# EAGLE design ShieldV21 (EAGLE 6.1)
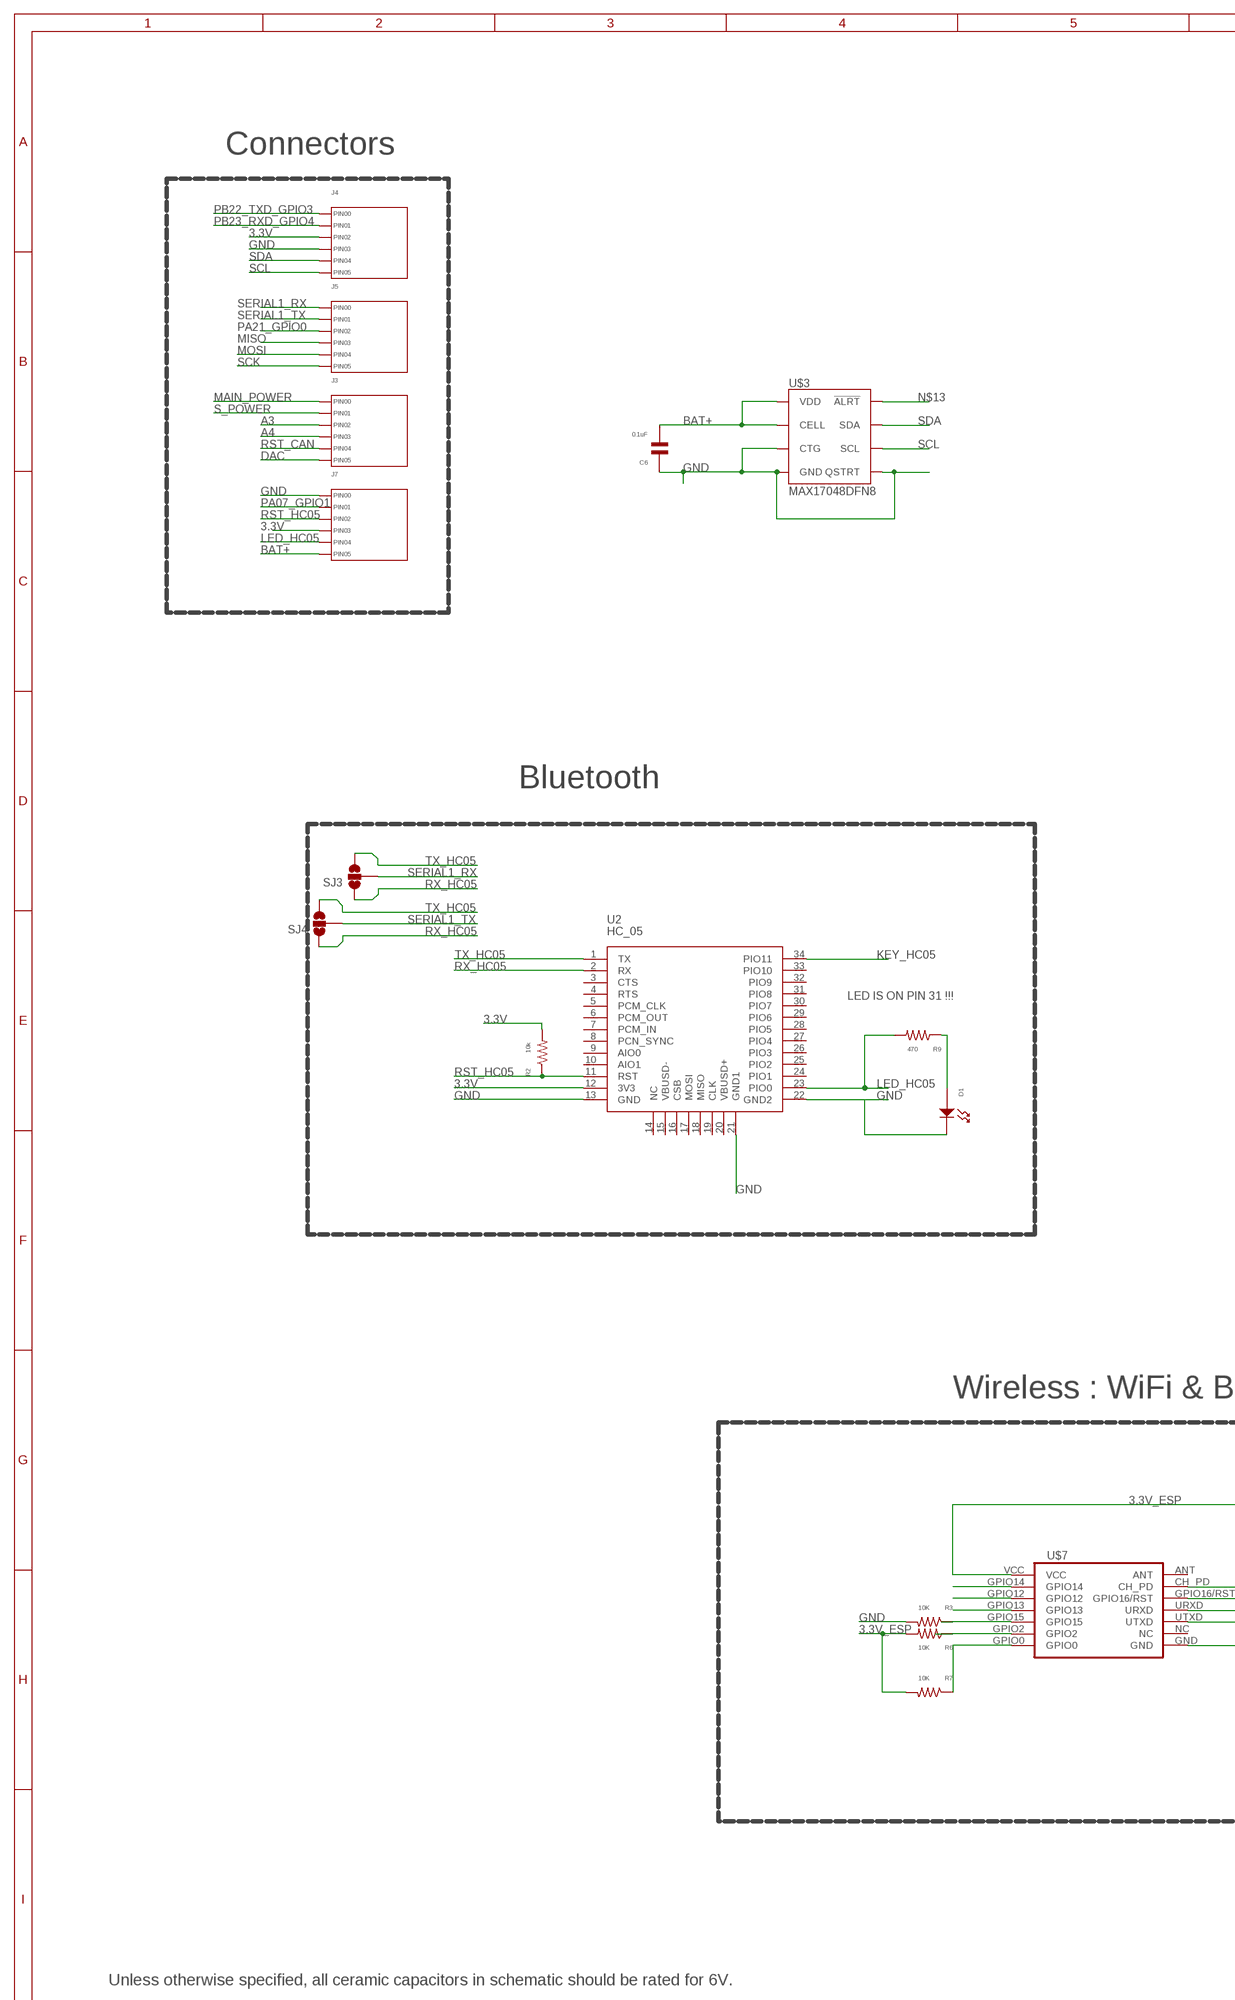
[diagram p0: schematic, sheet 1, part 1 of 2]
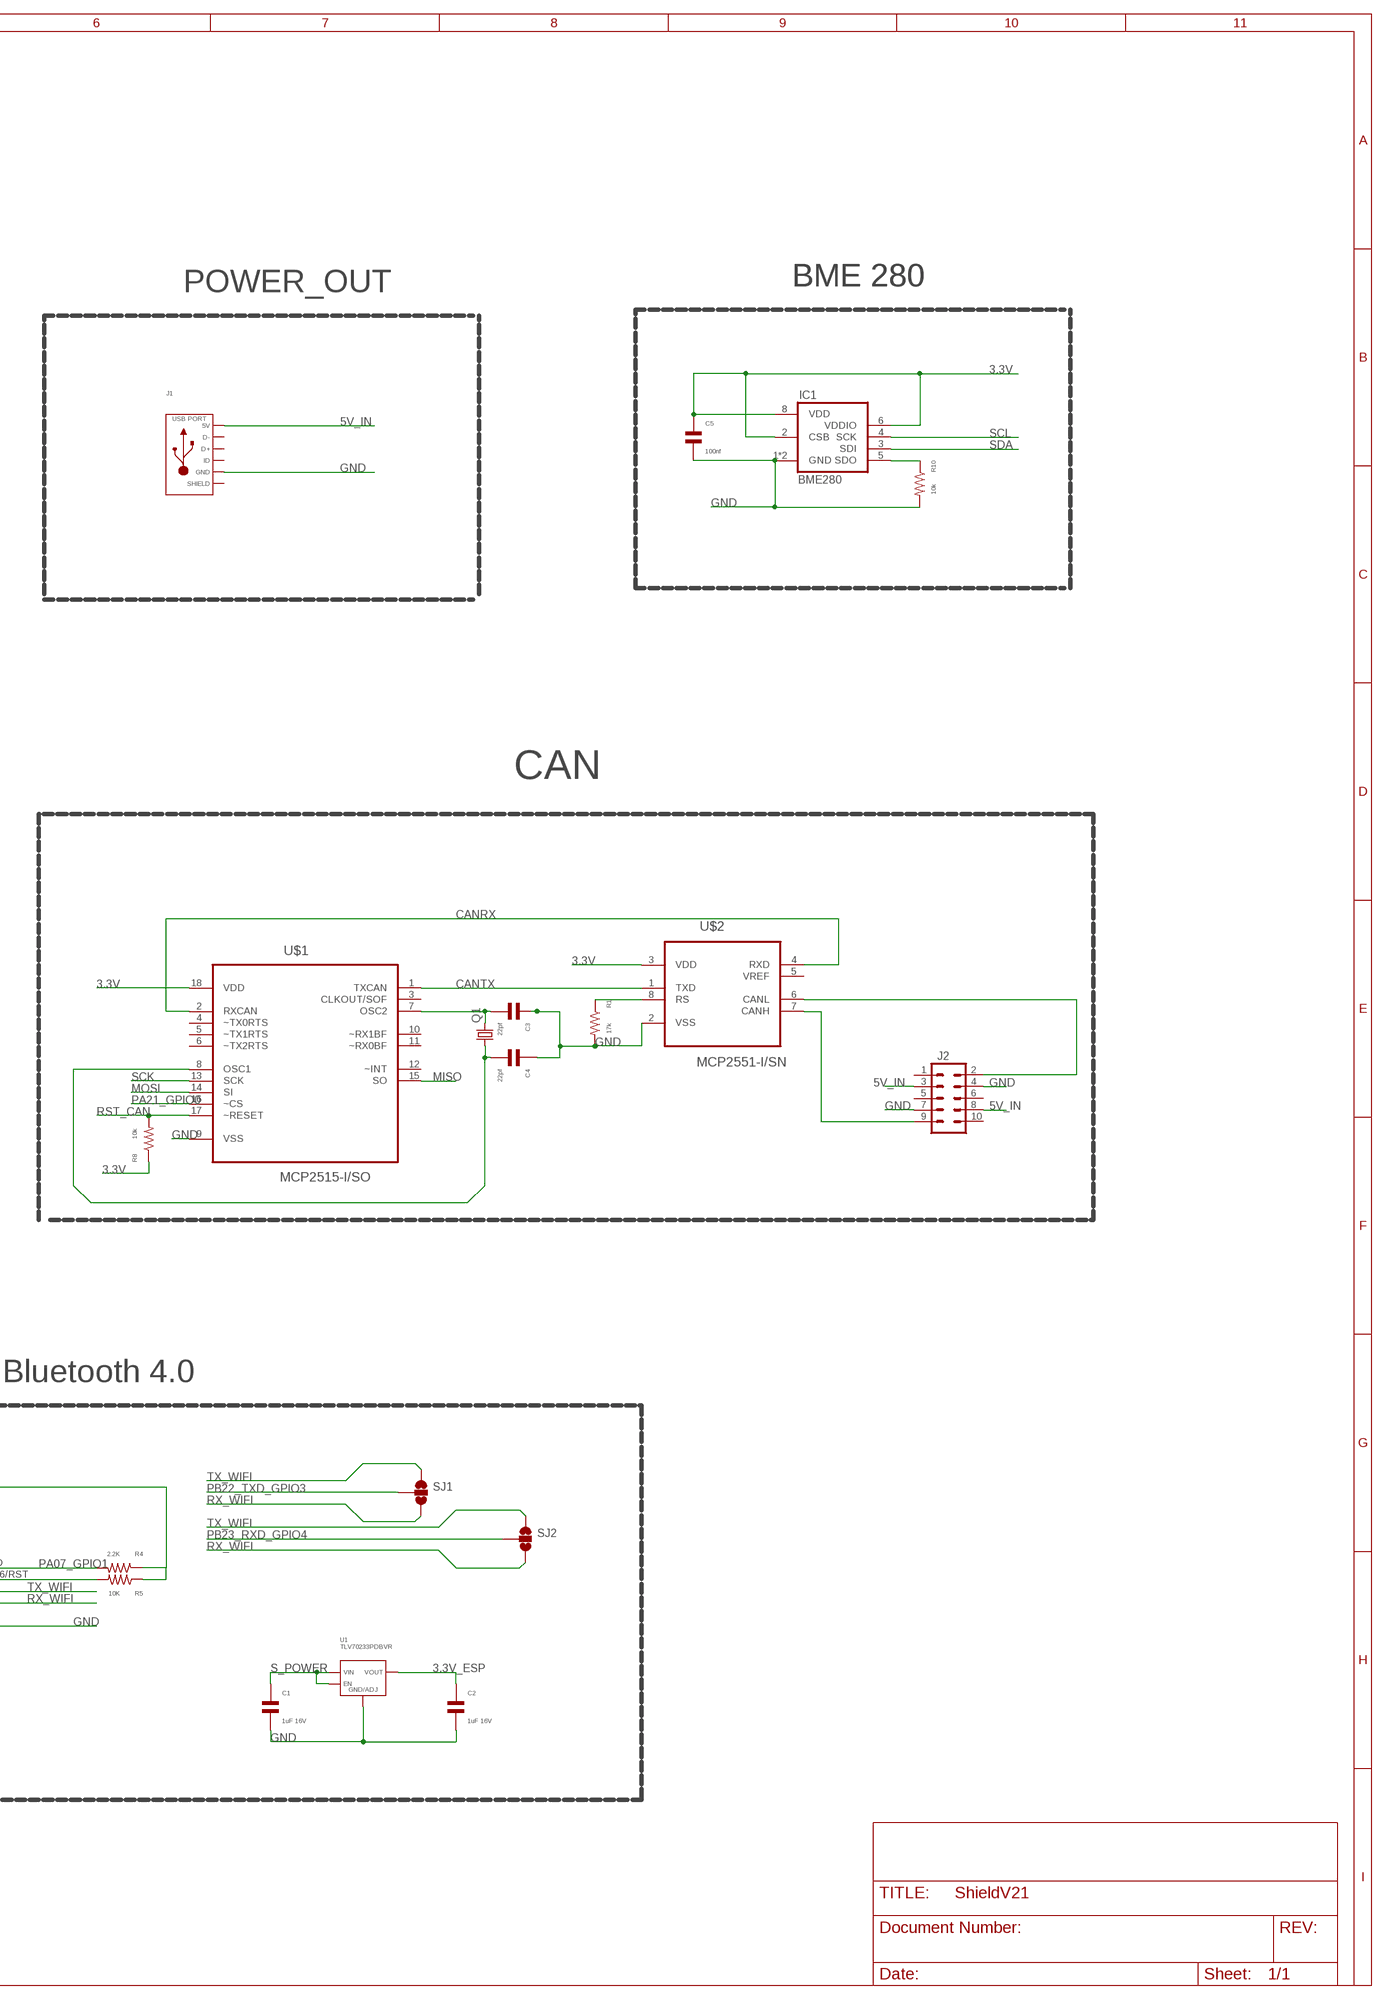
[diagram p1: schematic, sheet 1, part 2 of 2]

## Parts
C1  1uF 16V  CAPACITOR_NP_0402  [C0402]
C2  1uF 16V  CAPACITOR_NP_0402  [C0402]
C3  22pf  CAPACITOR_NP_0402  [C0402]
C4  22pf  CAPACITOR_NP_0402  [C0402]
C5  100nf  CAPACITOR_NP_0402  [C0402]
C6  0.1uF  CAPACITOR_NP_0402  [C0402]
D1  LED_SINGLE_0805  [LED0805]
IC1  BME280  [BME280]
J1  USB_MICRO_RIGHT  [MICROUSB-RIGHT]
J2  M05X2RA  [2X5-RA]
J3  HEADER_01X06_PTH_2.54MM  [PTH_2.54MM_01X06]
J4  HEADER_01X06_PTH_2.54MM  [PTH_2.54MM_01X06]
J5  HEADER_01X06_PTH_2.54MM  [PTH_2.54MM_01X06]
J7  HEADER_01X06_PTH_2.54MM  [PTH_2.54MM_01X06]
Q1  CRYSTALHC49UP  [HC49UP]
R1  17k  RESISTOR_0402  [R0402]
R2  10k  RESISTOR_0402  [R0402]
R3  10K  RESISTOR_0402  [R0402]
R4  2.2K  RESISTOR_0402  [R0402]
R5  10K  RESISTOR_0402  [R0402]
R6  10K  RESISTOR_0402  [R0402]
R7  10K  RESISTOR_0402  [R0402]
R8  10k  RESISTOR_0402  [R0402]
R9  470  RESISTOR_0402  [R0402]
R10  10k  RESISTOR_0402  [R0402]
SJ1  SOLDERJUMPER_2WAYS  [SJ_3]
SJ2  SOLDERJUMPER_2WAYS  [SJ_3]
SJ3  SOLDERJUMPER_2WAYS  [SJ_3]
SJ4  SOLDERJUMPER_2WAYS  [SJ_3]
U1  TLV70233PDBVR  [SOT-23-5]
U2  HC_05  [BLUETOOTH_SMD]
U$1  MCP2515-I/SO  [SOIC127P1034X264-18N]
U$2  MCP2551-I/SN  [SOIC127P600X175-8N]
U$3  MAX17048DFN8  [DFN-8]
U$7  ESP-03_NO_SOLDER  [ESP-03_NO_SOLDER_PASTE]

## Nets
3.3V [3.3V]: C5.P$1 IC1.2(CSB) IC1.6(VDDIO) IC1.8(VDD) J4.P$3(PIN2) J7.P$4(PIN3) R2.P$2 R8.P$1 U2.12(3V3) U$1.18(VDD) U$2.3(VDD)
3.3V_ESP: C2.P$1 R4.P$1 R5.P$1 R6.P$2 R7.P$2 U1.P$5(VOUT) U$7.VCC
5V_IN: J1.1(5V) J2.3 J2.8
A3: J3.P$3(PIN2)
A4: J3.P$4(PIN3)
BAT+ [Large]: C6.P$2 J7.P$6(PIN5) U$3.P$2(CELL) U$3.P$3(VDD)
CANH: J2.9 U$2.7(CANH)
CANRX: U$1.2(RXCAN) U$2.4(RXD)
CANTX: U$1.1(TXCAN) U$2.1(TXD)
DAC: J3.P$6(PIN5)
GND [gnd]: C1.P$2 C2.P$2 C3.P$1 C4.P$1 C5.P$2 C6.P$1 D1.CATHODE IC1.1(GND) IC1.7(GND) J1.5(GND) J2.4 J2.7 J4.P$4(PIN3) J7.P$1(PIN0) R1.P$2 R3.P$2 R10.P$2 U1.P$2(GND/ADJ) U2.13(GND) U2.21(GND1) U2.22(GND2) U$1.9(VSS) U$2.2(VSS) U$3.P$1(CTG) U$3.P$4(GND) U$3.P$6(QSTRT) U$3.P$9(GND) U$7.GND
KEY_HC05 [gnd]: U2.34(PIO11)
LED_HC05: J7.P$5(PIN4) R9.P$2 U2.23(PIO0)
MAIN_POWER: J3.P$1(PIN0)
MISO: J5.P$4(PIN3) U$1.15(SO)
MOSI: J5.P$5(PIN4) U$1.14(SI)
N$3: D1.ANODE R9.P$1
N$5: C3.P$2 Q1.2 U$1.7(OSC2)
N$6: C4.P$2 Q1.1 U$1.8(OSC1)
N$7: J2.2 U$2.6(CANL)
N$8: R1.P$1 U$2.8(RS)
N$9: R5.P$2 U$7.GPIO16/RST
N$10: IC1.5(SDO) R10.P$1
N$13: U$3.P$5(!ALRT)
N$14 [audio]: R7.P$1 U$7.GPIO0
N$15 [audio]: R6.P$1 U$7.GPIO2
N$16 [audio]: R3.P$1 U$7.GPIO15
N$17 [audio]: U$7.GPIO13
N$18 [audio]: U$7.GPIO12
N$19 [audio]: U$7.GPIO14
PA07_GPIO1: J7.P$2(PIN1) R4.P$2 U$7.CH_PD
PA21_GPIO0: J5.P$3(PIN2) U$1.16(~CS)
PB22_TXD_GPIO3: J4.P$1(PIN0) SJ1.2
PB23_RXD_GPIO4: J4.P$2(PIN1) SJ2.2
RST_CAN: J3.P$5(PIN4) R8.P$2 U$1.17(~RESET)
RST_HC05: J7.P$3(PIN2) R2.P$1 U2.11(RST)
RX_HC05: SJ3.1 SJ4.1 U2.2(RX)
RX_WIFI: SJ1.3 SJ2.3 U$7.UTXD
S_POWER: C1.P$1 J3.P$2(PIN1) U1.P$1(VIN) U1.P$3(EN)
SCK: J5.P$6(PIN5) U$1.13(SCK)
SCL: IC1.4(SCK) J4.P$6(PIN5) U$3.P$7(SCL)
SDA: IC1.3(SDI) J4.P$5(PIN4) U$3.P$8(SDA)
SERIAL1_RX: J5.P$1(PIN0) SJ3.2
SERIAL1_TX: J5.P$2(PIN1) SJ4.2
TX_HC05: SJ3.3 SJ4.3 U2.1(TX)
TX_WIFI: SJ1.1 SJ2.1 U$7.URXD
Unconnected: J1.2(D-) J1.3(D+) J1.4(ID) J2.1 J2.5 J2.6 J2.10 U2.3(CTS) U2.4(RTS) U2.5(PCM_CLK) U2.6(PCM_OUT) U2.7(PCM_IN) U2.8(PCN_SYNC) U2.9(AIO0) U2.10(AIO1) U2.14(NC) U2.15(VBUSD-) U2.16(CSB) U2.17(MOSI) U2.18(MISO) U2.19(CLK) U2.20(VBUSD+) U2.24(PIO1) U2.25(PIO2) U2.26(PIO3) U2.27(PIO4) U2.28(PIO5) U2.29(PIO6) U2.30(PIO7) U2.31(PIO8) U2.32(PIO9) U2.33(PIO10) U$1.3(CLKOUT/SOF) U$1.4(~TX0RTS) U$1.5(~TX1RTS) U$1.6(~TX2RTS) U$1.10(~RX1BF) U$1.11(~RX0BF) U$1.12(~INT) U$2.5(VREF) U$7.ANT U$7.NC

## Notes on the sheet
- Connectors
- POWER_OUT | BME 280 | BME 280
- Bluetooth | CAN
- LED IS ON PIN 31 !!!
- Wireless : WiFi & Bluetooth 4.0
- Unless otherwise specified, all ceramic capacitors in schematic should be rated for 6V.

## Power pins joined to a net without a drawn wire
SLD: J1.S1(SLD) J1.S2(SLD) J1.S3(SLD) J1.S4(SLD) J1.S5(SLD) J1.S6(SLD)

## Library data of the parts
C1-C6 = MF_Passives:CAPACITOR_NP: Library: MF_Passives Description: Device for Non-Polarized Capacitors. Manufacture part number (MFG#), Voltage, Temperature Coefficient, and Tolerance can be added via Attributes.; MFG#: N/A; TEMP_COF: N/A; TOLERANCE: N/A; VOLTAGE: N/A
D1 = MF_LEDs:LED_SINGLE: Library: MF_LEDs Description: Device for Single LED Packages. Manufacture part number (MFG#) can be added via Attributes.
IC1 = bosch-bme280:BME280: DIGITAL HUMIDITY, PRESSURE AND TEMPERATURE SENSOR * Digital interface I²C (up to 3.4 MHz) and SPI (3 and 4 wire, up to 10 MHz)* Supply voltage VDD main supply voltage range: 1.71 V to 3.6 V*VDDIO interface voltage range: 1.2 V to 3.6 V Operating range -40…+85 °C, 0…100 % rel. humidity, 300…1100 hPa The library has been designed by Richard Magdycz <https://www.facebook.com/groups/eaglecadsoftUK>
J1 = MF_Connectors:USB: Library: MF_Connectors Description: 5 Pin USB Connectors. SLD is the shield connection. Usually tied to ground through a small ferrite bead.
J2 = SparkFun-Connectors:M05X2: Header 5x2 Standard 10-pin dual row 0.1" header. Commonly used with AVR-ISP. Use with Spark Fun Electronics SKU: PRT-00778
J3-J5 J7 = MF_Connectors:HEADER_01X06: Library: MF_Connectors Description: Header Connector with 6 Positions and 01 Rows. Use the LABEL Attribute to label the pin on the schematic and PCB. You can remove the attributes on the PCB by using the SMASH function on the part and then deleting the text.
Q1 = adafruit:CRYSTAL: CRYSTAL; OC_FARNELL: unknown; OC_NEWARK: unknown
R1-R10 = MF_Passives:RESISTOR: Library: MF_Passives Description: Device for Resistors. Manufacture part number (MFG#), Voltage, Tolerance, and Wattage Rating can be added via Attributes.; MFG#: N/A; TOLERANCE: N/A; VOLTAGE: N/A; WATTAGE: N/A
SJ1-SJ4 = SparkFun-Retired:SOLDERJUMPER_2WAY: Solder Jumper 2 way solder jumper
U1 = MF_IC_Power:TLV702: Manufacturer Part #: TLV702 Manufacturer: Texas Instruments Description: LDO Voltage Regulators
U2 = Bluetooth HC-05:HC_05: HC-05 Bluetooth Module
U$1 = Microchip_By_element14_Batch_1:MCP2515-I/SO: CAN Controller; MPN: MCP2515-I/SO; OC_FARNELL: 1292239; OC_NEWARK: 29H7136; PACKAGE: SOIC-18; SUPPLIER: Microchip
U$2 = Microchip_By_element14_Batch_1:MCP2551-I/SN: High-Speed CAN Transceiver; MPN: MCP2551-I/SN; OC_FARNELL: 9758569; OC_NEWARK: 69K7604; PACKAGE: SOIC-8; SUPPLIER: Microchip
U$3 = SparkFun-DigitalIC:MAX17048: Micropower 1-Cell Li+ ModelGauge
U$7 = ESP_03:ESP-03_NO_SOLDER

## Net classes
0 default: width 0.305 mm, drill 0.305 mm, clearance 0.203 mm
1 Large: width 0.406 mm, drill 0.305 mm, clearance 0.203 mm
2 gnd: width 0.406 mm, drill 0.305 mm, clearance 0.203 mm
3 3.3V: width 0.406 mm, drill 0.305 mm, clearance 0.203 mm
4 USBpair: width 0.305 mm, drill 0.305 mm, clearance 0.203 mm
5 audio: width 0.305 mm, drill 0.305 mm, clearance 0.203 mm

## Board
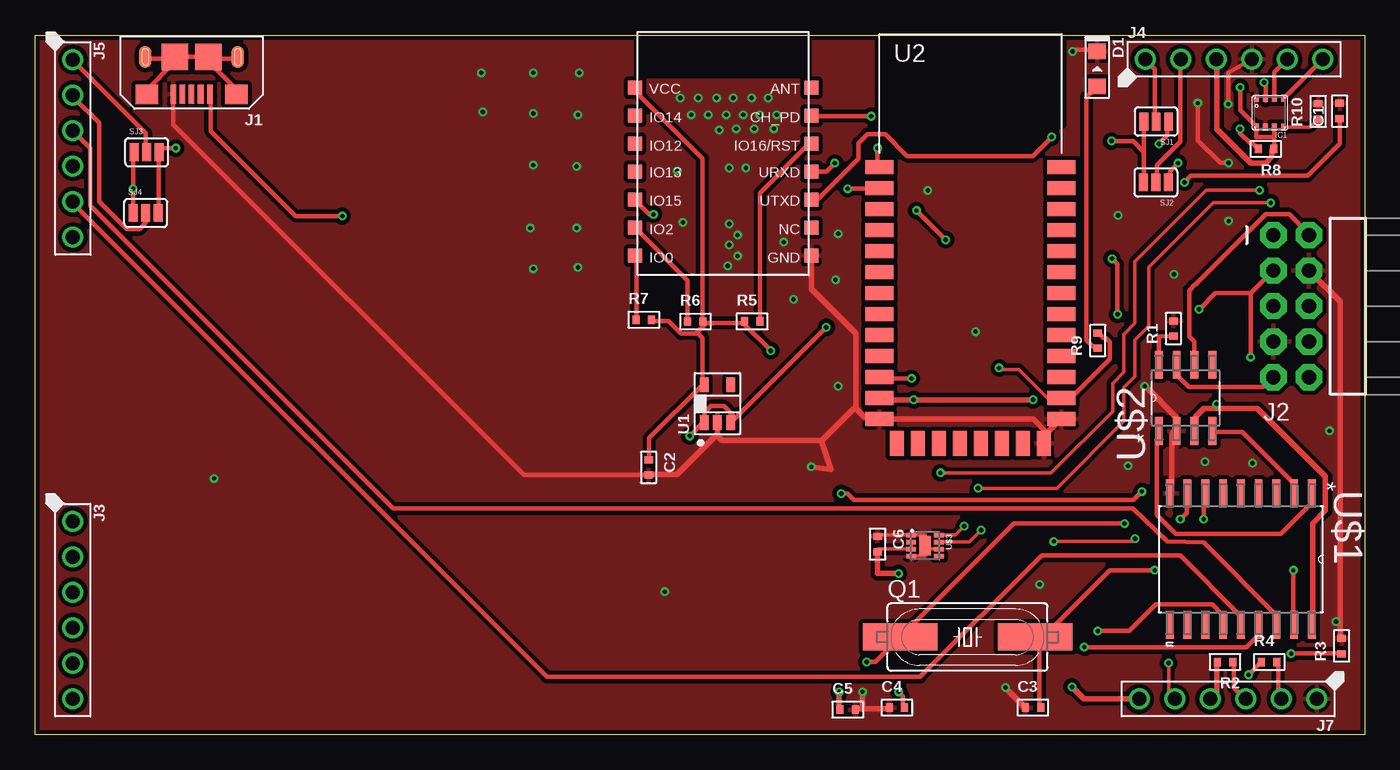
[diagram p2: board, top side]
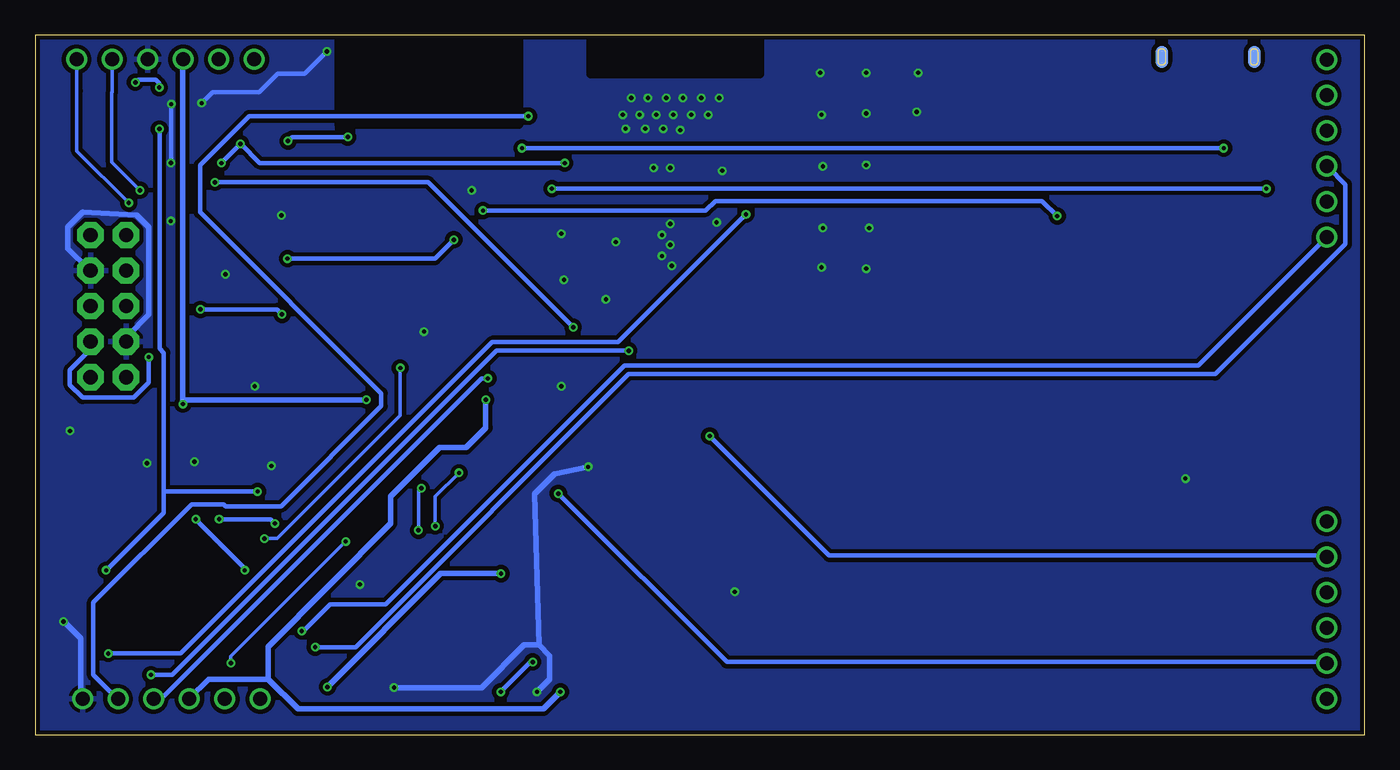
[diagram p3: board, bottom side, seen from below]

Size 95 x 50 mm. Coordinates in mm from the lower left corner, seen from the top.
Outline: 0,0 0,50 95,50 95,0 0,0
Copper layers (1*16): Top 0.035mm / dielectric 1.5mm / Bottom 0.035mm
Design rules: minimum track width 6mil, minimum drill 12mil, track to track 6mil, track to pad 6mil, pad to pad 6mil, via to via 6mil, smd to smd 0mil, copper to edge 10mil, drill to drill 10mil, minimum pad ring 6mil, minimum via ring 6mil, stop-mask expansion 2mil, vias tented up to drill 25mil, thermal gap 10mil
tKeepout: area 43.1,47.2 to 55.1,50.2
tRestrict: area 43.1,47.2 to 55.2,50.2; area 60.3,43.6 to 73.4,50
bRestrict: area 60.4,43.6 to 73.3,50; area 43.2,47.2 to 55.3,50.1

### Footprints (pad centres in the part's own frame; a part is rotated, then mirrored left to right if it is on the bottom)
C0402 = smd 0.5 x 0.6: P$1 -0.55,0; P$2 0.55,0
LED0805 = smd 1.1 x 1.25: ANODE 1.25,0; CATHODE -1.25,0
BME280 = smd 0.35 x 0.5: 1 0.975,-1.025; 2 0.325,-1.025; 3 -0.325,-1.025; 4 -0.975,-1.025; 5 -0.975,1.025; 6 -0.325,1.025; 7 0.325,1.025; 8 0.975,1.025
MICROUSB-RIGHT = smd 0.4 x 1.35: 1 -1.3,1.27; 2 -0.65,1.27; 3 0,1.27; 4 0.65,1.27; 5 1.3,1.27 | smd 0.9 x 1.6: S1 -3.3,-1.4; S2 3.3,-1.4 | smd 1.6 x 1.4: S3 -3.2,1.27; S4 3.2,1.27 | smd 1.9 x 1.9: S5 -1.2,-1.405; S6 1.2,-1.405 | smd 0.9 x 1.6 bottom: S7 -3.3,-1.4; S8 3.3,-1.4
2X5-RA = drill 1.016 pad 1.88 octagon: 1 -1.27,5.08; 2 1.27,5.08; 3 -1.27,2.54; 4 1.27,2.54; 5 -1.27,0; 6 1.27,0; 7 -1.27,-2.54; 8 1.27,-2.54; 9 -1.27,-5.08; 10 1.27,-5.08
PTH_2.54MM_01X06 = drill 1: P$1 -6.35,0; P$2 -3.81,0; P$3 -1.27,0; P$4 1.27,0; P$5 3.81,0; P$6 6.35,0
HC49UP = smd 5.334 x 1.93: 1 -4.826,0; 2 4.826,0
R0402 = smd 0.5 x 0.6: P$1 -0.55,0; P$2 0.55,0
SJ_3 = smd 0.635 x 1.27: 1 -0.889,0; 2 0,0; 3 0.889,0
SOT-23-5 = smd 1.05 x 0.6: P$1 -1.35,0.95; P$2 -1.35,0; P$3 -1.35,-0.95; P$4 1.35,-0.95; P$5 1.35,0.95
BLUETOOTH_SMD = smd 2 x 1: 1 -6.35,3.81; 2 -6.35,2.31; 3 -6.35,0.81; 4 -6.35,-0.69; 5 -6.35,-2.19; 6 -6.35,-3.69; 7 -6.35,-5.19; 8 -6.35,-6.69; 9 -6.35,-8.19; 10 -6.35,-9.69; 11 -6.35,-11.19; 12 -6.35,-12.69; 13 -6.35,-14.19; 22 6.65,-14.19; 23 6.65,-12.69; 24 6.65,-11.19; 25 6.65,-9.69; 26 6.65,-8.19; 27 6.65,-6.69; 28 6.65,-5.19; 29 6.65,-3.69; 30 6.65,-2.19; 31 6.65,-0.69; 32 6.65,0.81; 33 6.65,2.31; 34 6.65,3.81 | smd 1 x 1.8: 14 -5.1,-15.94; 15 -3.6,-15.94; 16 -2.1,-15.94; 17 -0.6,-15.94; 18 0.9,-15.94; 19 2.4,-15.94; 20 3.9,-15.94; 21 5.4,-15.94
SOIC127P1034X264-18N = smd 1.981 x 0.559: 1 -4.699,5.08; 2 -4.699,3.81; 3 -4.699,2.54; 4 -4.699,1.27; 5 -4.699,0; 6 -4.699,-1.27; 7 -4.699,-2.54; 8 -4.699,-3.81; 9 -4.699,-5.08; 10 4.699,-5.08; 11 4.699,-3.81; 12 4.699,-2.54; 13 4.699,-1.27; 14 4.699,0; 15 4.699,1.27; 16 4.699,2.54; 17 4.699,3.81; 18 4.699,5.08
SOIC127P600X175-8N = smd 1.981 x 0.559: 1 -2.362,1.905; 2 -2.362,0.635; 3 -2.362,-0.635; 4 -2.362,-1.905; 5 2.362,-1.905; 6 2.362,-0.635; 7 2.362,0.635; 8 2.362,1.905
DFN-8 = smd 0.3 x 0.7: P$1 -0.75,-0.99; P$2 -0.25,-0.99; P$3 0.25,-0.99; P$4 0.75,-0.99; P$5 0.75,0.99; P$6 0.25,0.99; P$7 -0.25,0.99; P$8 -0.75,0.99 | smd 1.38 x 0.8: P$9 0,0
ESP-03_NO_SOLDER_PASTE = smd 1 x 1: ANT -4.89,6.05; CH_PD -2.89,6.05; GND 7.11,6.05; GPIO0 7.11,-6.55; GPIO2 5.11,-6.55; GPIO12 -0.89,-6.55; GPIO13 1.11,-6.55; GPIO14 -2.89,-6.55; GPIO15 3.11,-6.55; GPIO16/RST -0.89,6.05; NC 5.11,6.05; URXD 1.11,6.05; UTXD 3.11,6.05; VCC -4.89,-6.55

### Placement (x,y rotation side)
C1  93.22,44.56 90 top
C2  43.85,19.09 270 top
C3  71.31,1.92 0 top
C4  61.59,1.92 0 top
C5  58.08,1.78 0 top
C6  60.2,13.6 270 top
D1  75.9,47.58 270 top
IC1  88.24,44.44 180 top
J1  11.19,47.03 180 top
J2  89.76,30.62 0 top
J3  2.7,8.9 270 top
J4  85.68,48.26 0 top
J5  2.7,41.9 270 top
J7  85.25,2.54 180 top
Q1  66.64,6.97 0 top
R1  81.35,29.02 90 top
R2  85.03,5.19 180 top
R3  93.37,6.33 90 top
R4  88.19,5.19 0 top
R5  51.24,29.53 0 top
R6  47.19,29.52 0 top
R7  43.51,29.65 0 top
R8  87.95,41.85 180 top
R9  75.94,28.16 90 top
R10  91.69,44.54 90 top
SJ1  80.11,43.81 180 top
SJ2  80.09,39.46 180 top
SJ3  7.98,41.62 0 top
SJ4  7.91,37.28 0 top
U1  48.76,23.65 90 top
U2  66.7,36.75 0 top
U$1  86.16,12.53 270 top
U$2  82.21,24.06 90 top
U$3  63.6,13.5 270 top
U$7  49.42,41.34 270 top

### Tracks (layer width: path | path; a pad name or v marks a point on that pad's centre or on a via)
3.3V  (via drill 0.3)
  Top 0.305: IC1.6 88.56,42.91 | 88.56,42.91 88.56,41.91 R8.P$1 | 88.56,42.91 88.56,42.7 87.47,42.7 87.26,42.71 87.25,42.71 87.27,42.8 IC1.8 87.27,43.48 86.12,44.62 v86.12,46.25 | v87.83,46.61 87.94,46.4 87.94,45.29 IC1.2
  Top 0.406: v57.45,3.05 57.45,1.83 C5.P$1 | R2.P$2 84.43,5.18 84.43,2.9 84.12,2.59 J7.P$4 | U2.12 60.35,23.93 v62.79,23.93 v71.32,23.93 | R8.P$1 88.39,41.76 88.39,41.3 87.94,40.84 86.87,40.84 84.43,43.28 84.43,48.16 J4.P$3 | 84.43,23.32 83.52,23.32 82.91,22.71 82.91,21.79 U$2.3 | 84.43,23.32 87.33,23.32 92.2,18.44 92.2,16 91.29,15.09 91.29,7.92 U$1.18 | v84.43,23.62 84.43,23.32
  Bottom 0.305: v86.12,46.25 86.12,46.55 86.37,46.8 87.64,46.8 v87.83,46.61
  Bottom 0.406: v57.45,3.05 58.67,1.83 76.2,1.83 78.33,3.96 | 78.33,3.96 82.6,3.96 83.97,2.59 J7.P$4 | v62.79,23.93 62.79,21.91 64.2,20.5 66.1,20.5 69.6,17 69.6,15.1 78.33,6.28 78.33,3.96 | J4.P$3 84.43,48.16 v84.43,23.62 84.28,23.93 v71.32,23.93
3.3V_ESP  (via drill 0.3)
  Top 0.305: C2.P$1 43.89,19.66 43.89,21.18 47.7,24.99 U1.P$5 47.7,25.15 47.7,28.35 47.32,28.73 | v86.72,4.27 R4.P$1 | v52.58,27.43 50.6,29.41 R5.P$1 50.44,29.41 47.85,29.41 R6.P$2 | 47.32,28.73 47.85,29.26 R6.P$2 | 47.32,28.73 47.24,28.65 46.18,28.65 45.26,29.57 44.2,29.57 R7.P$2 | U$7.VCC 42.98,46.18 42.98,45.87 47.7,41.15 47.7,29.57 R6.P$2
  Bottom 0.305: v86.72,4.27 85.19,4.27 62.03,27.43 v52.58,27.43
5V_IN  (via drill 0.3)
  Top 0.305: 86.87,31.55 v86.87,26.98 | 86.87,31.55 88.39,33.07 J2.3 | 86.87,31.55 84.34,31.55 v83.18,30.39 | v77.35,30.03 77.35,33.62 v76.96,34.01 | v65.07,35.36 v65.07,35.37 v62.99,37.45 | v21.96,37.06 18.64,37.06 12.56,43.14 12.56,45.69 J1.1
  Bottom 0.305: v86.87,26.98 86.87,25.15 87.94,24.08 91.59,24.08 92.51,24.99 92.51,26.06 91.14,27.43 91.14,28.04 J2.8 | v83.18,30.39 77.69,30.39 v77.35,30.03 | v76.96,34.01 66.42,34.01 v65.07,35.36 | v62.99,37.45 47.08,37.45 46.39,38.14 23.04,38.14 v21.96,37.06
BAT+  (via drill 0.3)
  Top 0.254: U$3.P$2 U$3.P$3 60.2,13.25 C6.P$2
  Top 0.406: J7.P$6 74.96,2.54 v74.1,3.4 | C6.P$2 60.2,11.5 v61.7,11.5
  Bottom 0.406: v61.7,11.5 66,11.5 v74.1,3.4
CANH
  Top 0.305: U$2.7 81.69,26.36 81.69,25.6 82.45,24.84 87.78,24.84 88.39,25.45 J2.9
CANRX
  Top 0.305: U$1.2 89.92,17.37 89.92,17.98 86.26,21.64 84.12,21.64 U$2.4
CANTX
  Top 0.305: U$2.1 80.16,21.64 80.16,15.7 81.53,14.33 89,14.33 91.14,16.46 91.14,17.22 U$1.1
GND  (via drill 0.3)
  Top 0.254: C6.P$1 60.2,14.25 U$3.P$1 63.6,14.25 U$3.P$9 | U$3.P$9 63.85,13.25 U$3.P$6 | U$3.P$9 63.6,12.75 U$3.P$4
  Top 0.305: C2.P$2 34.93,18.54 9.89,43.58 J1.5 | J4.P$4 85.28,47.3 v85.26,45.06 | v85.28,40.86 84.69,40.86 83.09,42.46 v83.09,45.13 | v74.15,48.82 74.15,48.91 74.2,48.96 75.57,48.96 D1.CATHODE
  Top 0.406: 93.27,8.08 93.27,30.94 91.14,33.07 J2.4 | 93.27,8.08 93.27,7.01 R3.P$2 | v92.96,8.08 93.27,8.08 | U$1.9 81.23,17.37 81.23,21.49 81.38,21.64 U$2.2 81.53,21.79 81.53,22.71 79.4,24.84 79.25,24.84 | 73.46,22.71 U2.22 73.3,22.55 72.24,21.49 72.24,20.88 U2.21 72.24,21.64 71.32,22.55 60.5,22.55 U2.13 60.2,22.71 59.28,22.71 58.67,23.32 | 59.13,1.83 60.96,1.83 C4.P$1 | 59.13,1.83 58.67,1.83 C5.P$2 | v69.34,3.35 70.71,1.98 C3.P$1 | 59.13,1.83 v59.13,3.05 | 48.69,21.41 48.77,21.49 48.77,22.25 U1.P$2 | 48.69,21.41 45.87,18.59 43.89,18.59 C2.P$2 | 58.67,23.32 58.67,28.65 55.47,31.85 55.47,34.14 U$7.GND | 48.69,21.41 49.07,21.03 56.24,21.03 | 56.24,21.03 58.52,23.32 58.67,23.32 | v55.48,19.13 56.88,18.94 56.24,20.88 56.24,21.03
  Bottom 0.305: v85.26,45.06 85.26,40.88 v85.28,40.86 | v83.09,45.13 v83.09,45.14 82.32,45.91 78.97,45.91 77.65,47.23 75.74,47.23 v74.15,48.82
  Bottom 0.406: v92.96,8.08 91.75,6.86 91.75,2.59 J7.P$1 | J2.7 88.39,28.19 88.39,28.5 86.87,30.02 86.87,36.27 87.73,37.14 91.59,37.34 92.66,36.27 92.66,34.75 91.14,33.22 J2.4 | v69.34,3.35 63.09,3.35 60.05,6.4 58.98,6.4 | 58.98,6.4 58.22,5.64 58.22,3.96 v59.13,3.05 | v55.48,19.13 57.88,18.62 59.3,17.2 58.98,6.4
  other vias: 12.8,18.3 45,10.2 63.8,38.9 67.2,28.8 57.4,24.9 49.4,44.3 50.6,44.3 51.8,44.3 53,44.3 48.1,44.3 46.9,44.3 47.4,45.5 48.7,45.5 49.9,45.5 51.2,45.5 52.4,45.5 48.9,43.2 50.1,43.3 51.4,43.3 52.8,43.3 49.6,40.5 50.8,40.5 49.6,36.5 50.2,35.7 49.6,35 50.2,34.2 49.5,33.5 46.3,36.6 45.9,40.3 53.5,35.2 46.1,45.5 38.9,47.3 38.8,44.3 35.6,47.3 35.6,44.4 31.9,47.3 32,44.5 38.7,40.6 35.6,40.7 38.7,36.2 38.8,33.4 35.6,33.3 35.4,36.2 57.4,35.8 57.2,32.5 54.2,31.1 81.4,32.9 78.1,19.2 83.6,19.5 92.5,21.7 85.3,36.7 77.4,37.1 87,19.4 79.3,24.9 71.78,10.73
  pour Top (isolate 0.305): 0,50 0,0 95,0 95,50
  pour Bottom (isolate 0.305): -0.9,50.7 96.1,50.7 96.1,-1 -0.9,-1
LED_HC05  (via drill 0.3)
  Top 0.254: J7.P$5 81,2.98 v81,5.1 | v72.8,13.8 78.4,13.8 v78.6,14 | U2.23 72.34,24.06 70.3,26.1 69,26.1 v68.9,26.2
  Top 0.305: R9.P$2 76.05,28.65 76.35,28.35 76.5,28.35 76.81,28.04 76.81,26.82 74.07,24.08 73.46,24.08 U2.23
  Bottom 0.254: v81,5.1 81,5.6 v72.8,13.8 | v68.9,26.2 68.9,22.8 77.7,14 v78.6,14
MISO  (via drill 0.3)
  Top 0.305: v74.98,6.25 86.56,6.25 87.33,7.01 87.33,7.77 U$1.15
  Bottom 0.305: v74.98,6.25 72.08,6.25 52.58,25.76 10.67,25.76 1.37,35.05 1.37,39.32 2.59,40.54 J5.P$4
MOSI
  Top 0.305: U$1.14 86.11,7.92 86.11,8.53 81.84,12.8 71.93,12.8 63.25,4.12 36.58,4.12 2.74,37.95 J5.P$5
N$3
  Top 0.305: R9.P$1 75.89,27.74 75.59,27.74 75.13,28.19 75.13,45.57 D1.ANODE
N$5  (via drill 0.3)
  Top 0.305: C3.P$2 71.78,1.98 71.78,6.55 71.48,6.86 Q1.2 71.78,6.71 76.81,11.73 v80.01,11.73 | v83.52,15.39 83.52,17.22 U$1.7
  Bottom 0.305: v83.52,15.39 80.01,11.89 v80.01,11.73
N$6  (via drill 0.3)
  Top 0.305: v61.72,3.05 62.03,2.74 62.03,1.98 C4.P$2 | v59.44,5.18 60.05,5.18 61.72,6.86 Q1.1 61.87,7.01 69.95,15.09 v77.86,15.09 | v81.84,15.39 82.3,15.85 82.3,17.22 U$1.8
  Bottom 0.305: v61.72,3.05 59.59,5.18 v59.44,5.18 | v81.84,15.39 78.16,15.39 v77.86,15.09
N$7
  Top 0.305: 82.91,26.52 U$2.6 82.83,26.44 82.83,28.09 82.47,28.45 82.47,31.74 82.89,32.16 82.91,32.16 87.94,37.19 89.61,37.19 90.98,35.81 J2.2
N$8
  Top 0.305: R1.P$1 80.31,28.46 80.31,26.52 U$2.8
N$9
  Top 0.305: R5.P$2 51.82,29.57 51.82,38.71 55.32,42.22 U$7.GPIO16/RST
N$10
  Top 0.254: IC1.5 91.11,43.41 91.6,43.9 R10.P$1
N$14
  Top 0.305: R7.P$1 42.98,29.72 42.98,34.14 U$7.GPIO0
N$15
  Top 0.305: R6.P$1 46.63,29.57 46.63,32.46 42.98,36.12 U$7.GPIO2
N$16  (via drill 0.3)
  Top 0.305: v89.76,5.79 93.27,5.79 R3.P$1 | v44.2,37.19 43.89,37.19 42.98,38.1 U$7.GPIO15
  Bottom 0.305: v89.76,5.79 84.58,5.79 62.33,28.04 53.34,28.04 v44.2,37.19
PA07_GPIO1  (via drill 0.3)
  Top 0.305: R4.P$2 88.85,5.18 88.85,2.74 89,2.59 J7.P$2 | v59.74,44.2 55.47,44.2 U$7.CH_PD
  Bottom 0.305: v59.74,44.2 79.7,44.2 83.21,40.69 83.21,37.34 70.26,24.38 70.26,23.47 77.42,16.31 81.38,16.31 81.53,16.46 83.82,16.46 90.83,9.45 90.83,4.27 89.15,2.59 J7.P$2
PA21_GPIO0
  Top 0.305: U$1.16 88.7,7.92 88.7,8.53 83.52,13.72 80.9,13.82 78.46,16.15 25.6,16.15 3.96,37.8 3.96,41.91 2.74,43.13 J5.P$3
PB22_TXD_GPIO3
  Top 0.305: SJ1.2 80.01,43.89 80.01,47.55 79.4,48.16 J4.P$1
PB23_RXD_GPIO4
  Top 0.305: SJ2.2 80.16,39.47 80.16,40.69 81.84,42.37 81.84,48.16 J4.P$2
RST_CAN  (via drill 0.3)
  Top 0.305: v86.11,43.28 86.11,42.98 86.87,42.22 87.02,42.22 87.33,41.91 R8.P$2 | v89.92,11.73 89.92,7.92 U$1.17 | v57.61,17.22 58.06,17.22 58.52,16.76 78.49,16.76 v79.1,17.37
  Bottom 0.305: v86.11,43.28 86.11,27.58 85.8,27.28 85.8,17.37 | 85.8,17.37 85.8,15.85 v89.92,11.73 | v57.61,17.22 45.57,5.18 2.74,5.18 J3.P$5 | 85.8,17.37 v79.1,17.37
RST_HC05  (via drill 0.3)
  Top 0.305: R2.P$1 85.65,5.18 85.65,3.35 86.41,2.59 J7.P$3 | v62.64,25.45 60.35,25.45 U2.11
  Bottom 0.305: v62.64,25.45 63.09,25.45 85.95,2.59 86.41,2.59 J7.P$3
RX_HC05  (via drill 0.3)
  Top 0.305: SJ4.1 7.01,37.34 v7.01,39.01 7.01,41.6 SJ3.1 | v58.06,39.01 60.2,39.01 U2.2
  Bottom 0.305: v7.01,39.01 v58.06,39.01
RX_WIFI  (via drill 0.3)
  Top 0.305: U$7.UTXD 55.47,38.25 55.93,38.25 58.83,41.15 58.83,42.28 59.47,42.92 60.75,42.92 62.32,41.35 71.29,41.35 v72.65,42.71 | 79.1,43.89 SJ1.3 79.25,43.74 79.25,41.64 | 79.25,41.64 79.25,39.47 SJ2.3 | v76.92,42.42 78.47,42.42 79.25,41.64
  Bottom 0.305: v72.65,42.71 76.63,42.71 v76.92,42.42
S_POWER  (via drill 0.3)
  Top 0.305: v82.14,39.47 82.6,39.93 90.93,39.93 93.22,42.22 C1.P$1 | v56.54,29.11 49.84,22.4 U1.P$3 49.99,22.71 49.23,23.47 48.31,23.47 47.85,23.01 47.85,22.4 U1.P$1 47.7,22.25 v46.79,21.34
  Bottom 0.305: v82.14,39.47 66.9,39.47 v56.54,29.11 | v46.79,21.34 38.25,12.8 2.74,12.8 J3.P$2
SCK  (via drill 0.3)
  Top 0.305: v75.94,7.4 78.2,7.4 80.1,9.3 84.12,9.3 84.89,8.53 84.89,7.92 U$1.13
  Bottom 0.305: v75.94,7.4 75.8,7.4 73.9,9.3 69.95,9.3 52.88,26.36 11.89,26.36 2.74,35.51 J5.P$6
SCL  (via drill 0.3)
  Top 0.254: U$3.P$7 66.75,13.75 v67.6,14.6 | v67.4,17.6 73,17.6 77.8,22.4 77.8,24.8 78.6,25.6 78.6,28.2 79.6,29.2 79.6,33.4 84.2,38 v88.3,38
  Top 0.305: IC1.4 89.31,45.57 91.9,48.16 J4.P$6
  Bottom 0.254: v67.6,14.6 67.6,17.4 v67.4,17.6 | v88.3,38 92,41.7 92,46 92.03,46.03 J4.P$6
SDA  (via drill 0.3)
  Top 0.254: U$3.P$8 65.75,14.25 v66.4,14.9 | v64.7,18.7 72.6,18.7 77,23.1 77,25.1 77.8,25.9 77.8,28.6 78.6,29.4 78.6,33.8 83.7,38.9 v87.5,38.9
  Top 0.305: IC1.3 88.56,47.34 J4.P$5
  Bottom 0.254: v66.4,14.9 66.4,17 v64.7,18.7 | v87.5,38.9 89.5,40.9 89.5,45.9 89.49,45.91 J4.P$5
SERIAL1_RX
  Top 0.305: SJ3.2 7.92,41.76 7.92,42.98 2.74,48.16 J5.P$1
SERIAL1_TX
  Top 0.305: SJ4.2 7.92,37.19 7.92,36.58 7.47,36.12 6.55,36.12 4.57,38.1 4.57,43.74 2.74,45.57 J5.P$2
SLD
  Top 0.305: 9.91,48.31 9.91,48.01 8.08,46.18 8.08,45.87 J1.S4 | 9.91,48.31 J1.S6 10.06,48.46 12.34,48.46 J1.S5 12.5,48.31 | 12.5,48.31 12.5,48.01 14.33,46.18 14.33,45.87 J1.S3 | 12.5,48.31 14.37,48.31 J1.S1 | 9.91,48.31 8.01,48.31 J1.S2
TX_HC05  (via drill 0.3)
  Top 0.305: SJ4.3 8.84,37.34 8.84,41.6 SJ3.3 8.99,41.76 9.14,41.91 v10.06,41.91 | v60.2,41.91 60.2,40.69 U2.1
  Bottom 0.305: v10.06,41.91 v60.2,41.91
TX_WIFI  (via drill 0.3)
  Top 0.305: v57.15,40.84 56.54,40.23 U$7.URXD | v80.31,42.22 80.92,42.82 80.92,43.74 SJ1.1 | v81.69,40.84 81.08,40.23 81.08,39.47 SJ2.1
  Bottom 0.305: v57.15,40.84 78.94,40.84 v80.31,42.22 v81.69,40.84

### Text on the board
tStop: T. Meyer | T. Bhal | C. Vermot
tTest: BLE_RX | BLE_TX | Projet ingénieur 2016 | DaughterBoard V2.1 | www.aloyse.fr
bTest: CL | 12V | G | 5V | 3 | 3V | 5 | GND | 12 | CH | www.aloyse.fr